# EAGLE design KN-CON + LCD 100мм  (EAGLE 6.2)
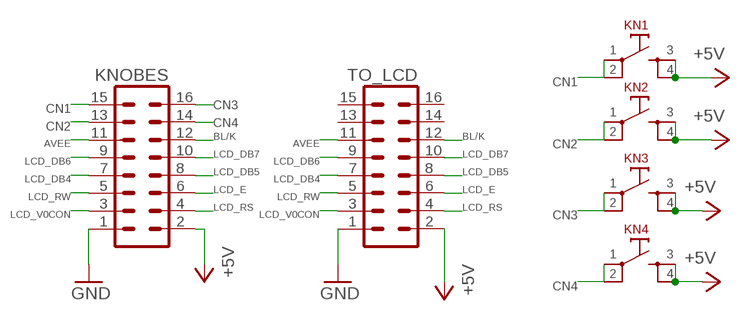
[diagram p0: schematic, sheet 1]

## Parts
KN1  LZQ-KN  [LZQ-KN]
KN2  LZQ-KN  [LZQ-KN]
KN3  LZQ-KN  [LZQ-KN]
KN4  LZQ-KN  [LZQ-KN]
KNOBES  ML16  [ML16]
TO_LCD  ML16  [ML16]

## Nets
+5V: KN1.3 KN1.4 KN2.3 KN2.4 KN3.3 KN3.4 KN4.3 KN4.4 KNOBES.2 TO_LCD.2
AVEE: KNOBES.11 TO_LCD.11
BL/K: KNOBES.12 TO_LCD.12
CN1: KN1.1 KN1.2 KNOBES.15
CN2: KN2.1 KN2.2 KNOBES.13
CN3: KN3.1 KN3.2 KNOBES.16
CN4: KN4.1 KN4.2 KNOBES.14
GND: KNOBES.1 TO_LCD.1
LCD_DB4: KNOBES.7 TO_LCD.7
LCD_DB5: KNOBES.8 TO_LCD.8
LCD_DB6: KNOBES.9 TO_LCD.9
LCD_DB7: KNOBES.10 TO_LCD.10
LCD_E: KNOBES.6 TO_LCD.6
LCD_RS: KNOBES.4 TO_LCD.4
LCD_RW: KNOBES.5 TO_LCD.5
LCD_V0CON: KNOBES.3 TO_LCD.3
Unconnected: TO_LCD.13 TO_LCD.14 TO_LCD.15 TO_LCD.16

## Library data of the parts
KN1-KN4 = Dmitry:LZQ-KN
KNOBES TO_LCD = con-harting-ml:ML16: HARTING; OC_FARNELL: unknown; OC_NEWARK: unknown

## Board
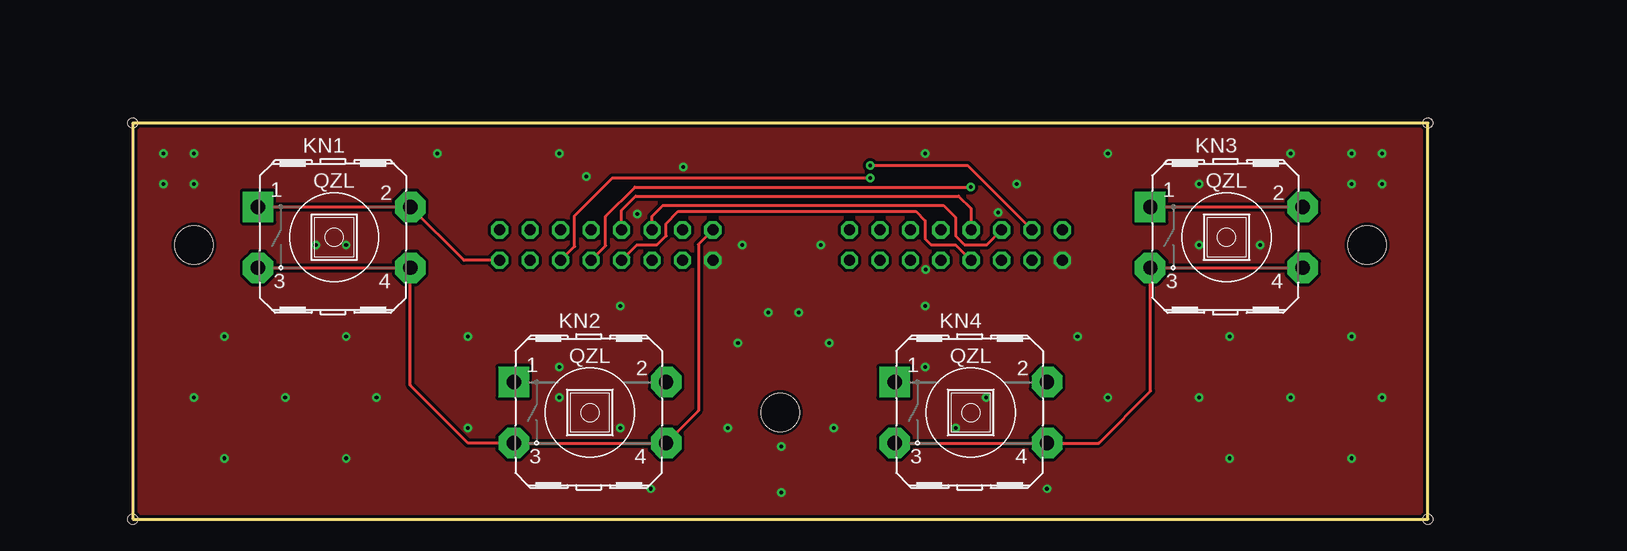
[diagram p1: board, top side]
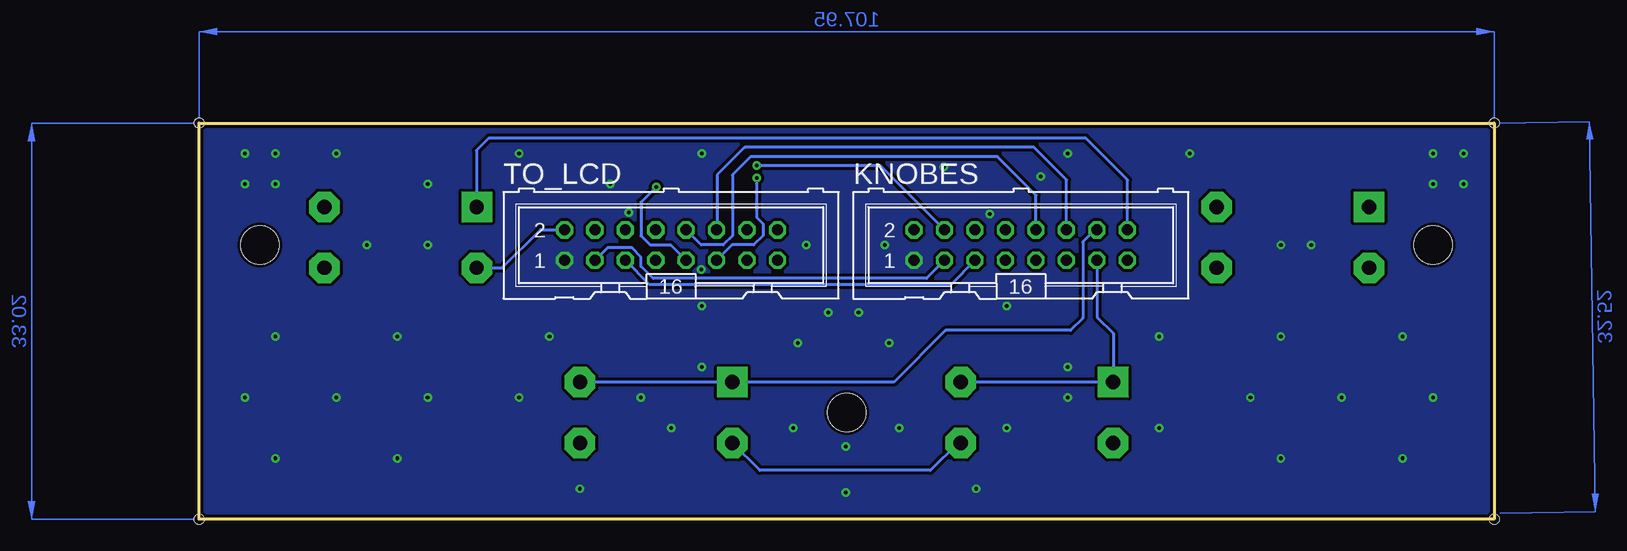
[diagram p2: board, bottom side, seen from below]

Size 107.95 x 33.02 mm. Coordinates in mm from the lower left corner, seen from the top.
Outline: 0,0 107.95,0 107.95,33.02 0,33.02 0,0
Copper layers (1*16): Top 0.035mm / dielectric 1.5mm / Bottom 0.035mm
Design rules: minimum track width 10mil, minimum drill 24mil, track to track 8mil, track to pad 8mil, pad to pad 8mil, via to via 8mil, smd to smd 8mil, copper to edge 10mil, drill to drill 8mil, minimum pad ring 10mil, minimum via ring 8mil, stop-mask expansion 4mil, vias tented up to drill 0mil, thermal gap 10mil
Holes 3.2 mm at 5.08,22.86 102.87,22.86 53.98,8.89
Holes 0.8 mm at 0,33.02 0,0 107.95,0 107.95,33.02

### Footprints (pad centres in the part's own frame; a part is rotated, then mirrored left to right if it is on the bottom)
LZQ-KN = drill 1.2 pad 2.54 square: 1 -6.35,2.54 | drill 1.2 pad 2.54 octagon: 2 6.35,2.54; 3 -6.35,-2.54; 4 6.35,-2.54
ML16 = drill 0.914 octagon: 1 -8.89,-1.27; 2 -8.89,1.27; 3 -6.35,-1.27; 4 -6.35,1.27; 5 -3.81,-1.27; 6 -3.81,1.27; 7 -1.27,-1.27; 8 -1.27,1.27; 9 1.27,-1.27; 10 1.27,1.27; 11 3.81,-1.27; 12 3.81,1.27; 13 6.35,-1.27; 14 6.35,1.27; 15 8.89,-1.27; 16 8.89,1.27

### Placement (x,y rotation side)
KN1  16.78,23.5 0 top
KN2  38.1,8.89 0 top
KN3  91.17,23.5 0 top
KN4  69.85,8.89 0 top
KNOBES  39.46,22.83 0 bottom
TO_LCD  68.61,22.83 0 bottom

### Tracks (layer width: path | path; a pad name or v marks a point on that pad's centre or on a via)
+5V
  Top 0.254: KN1.3 KN1.4 23.11,20.94 23.11,11.18 27.94,6.35 KN2.3 KN2.4 47.14,9.04 47.14,22.9 KNOBES.2 | KN4.3 KN4.4 80.52,6.35 84.84,10.67 84.84,20.94 | 84.84,20.94 KN3.3 | 84.84,20.94 97.5,20.94 KN3.4
  Bottom 0.254: KN2.4 44.7,6.35 46.99,4.06 61.21,4.06 KN4.3 | KN3.3 82.68,20.95 79.5,24.13 77.43,24.13 TO_LCD.2
AVEE  (via drill 0.3 pad 0.6)
  Top 0.254: KNOBES.11 36.83,22.75 36.83,25.3 39.98,28.45 v61.47,28.45
  Bottom 0.254: v61.47,28.45 61.47,25.15 60.96,24.64 60.96,23.62 61.72,22.86 63.51,22.86 TO_LCD.11
BL/K
  Bottom 0.254: KNOBES.12 35.65,28.28 38.35,30.99 62.48,30.99 64.77,28.7 64.77,24.14 TO_LCD.12
CN1
  Top 0.254: KN1.1 KN1.2 27.6,21.57 KNOBES.15
CN2
  Bottom 0.254: KN2.2 KN2.1 31.75,15.49 33.11,16.85 KNOBES.13
CN3
  Top 0.254: KN3.1 KN3.2
  Bottom 0.254: KNOBES.16 30.57,28.28 34.04,31.75 83.82,31.75 84.84,30.73 84.84,26.05 KN3.1
CN4
  Bottom 0.254: KN4.2 KN4.1 50.04,11.43 45.72,15.75 35.31,15.75 34.29,16.76 34.29,23.11 33.3,24.11 KNOBES.14
GND  (via drill 0.3 pad 0.6)
  other vias: 27.94,7.62 35.56,10.16 40.64,7.62 27.94,15.24 43.18,2.54 76.2,2.54 91.44,5.08 101.6,5.08 104.14,10.16 101.6,15.24 104.14,27.94 96.52,30.48 88.9,27.94 81.28,30.48 73.66,27.94 66.04,30.48 52.98,17.22 25.4,30.48 40.64,17.78 55.52,17.22 66.04,17.78 78.74,15.24 81.28,10.16 88.9,10.16 96.52,10.16 91.44,15.24 68.58,7.62 71.12,10.16 58.06,14.68 50.44,14.68 35.56,30.48 50.8,22.86 57.35,22.86 17.78,22.86 15.24,22.86 88.9,22.86 93.98,22.86 7.62,5.08 17.78,5.08 20.32,10.16 17.78,15.24 5.08,10.16 12.7,10.16 7.62,15.24 54.05,2.24 49.58,7.62 5.08,30.48 5.08,27.94 2.54,27.94 2.54,30.48 101.6,27.94 104.14,30.48 101.6,30.48 58.42,7.62 54.05,6.05 35.56,12.7 66.04,12.7 37.8,28.55 45.87,29.36 72.14,25.55 66.09,20.83 42.06,25.45
  pour Top (isolate 0.25, no thermals): 0,33.02 0,0 107.95,0 107.95,33.02
  pour Bottom (isolate 0.25, no thermals): 0,33.02 107.95,33.02 107.95,0 -0.51,0.51
LCD_DB4
  Top 0.254: KNOBES.7 42.02,22.86 43.69,22.86 44.45,23.62 44.45,24.64 45.47,25.65 65.28,25.65 66.04,24.89 66.04,23.37 66.55,22.86 68.58,22.86 TO_LCD.7
LCD_DB5
  Top 0.254: KNOBES.8 40.73,25.74 41.91,26.92 68.83,26.92 69.85,25.91 69.85,24.14 TO_LCD.8
LCD_DB6  (via drill 0.3 pad 0.6)
  Top 0.254: KNOBES.9 39.42,22.8 39.42,25.25 41.86,27.69 v69.85,27.69
  Bottom 0.254: v69.85,27.69 71.12,26.42 71.12,23.62 70.36,22.86 68.64,22.86 TO_LCD.9
LCD_DB7
  Bottom 0.254: KNOBES.10 38.19,27.01 41.4,30.23 61.98,30.23 63.5,28.7 63.5,23.62 64.26,22.86 66.1,22.86 TO_LCD.10
LCD_E
  Top 0.254: KNOBES.6 43.27,25.23 44.2,26.16 67.56,26.16 68.58,25.15 68.58,23.62 69.34,22.86 71.18,22.86 TO_LCD.6
LCD_RS  (via drill 0.3 pad 0.6)
  Top 0.254: TO_LCD.4 69.61,29.46 v61.47,29.46
  Bottom 0.254: KNOBES.4 51.16,29.46 v61.47,29.46
LCD_RW
  Bottom 0.254: KNOBES.5 45.27,19.56 70.42,19.56 TO_LCD.5
LCD_V0CON
  Bottom 0.254: KNOBES.3 47.3,20.07 70.1,20.07 71.12,21.08 71.12,21.84 71.88,22.61 73.92,22.61 TO_LCD.3
(copper drawn outside any net)
  shapes: Bottom area x3

### Text on the board
Drill_legend: Drill legend | Date: 05.05.2012 14:55:05 | 3.2000 mm / 125.984 mil | 1.2000 mm / 47.244 mil | 1.0000 mm / 39.370 mil | 0.8000 mm / 31.496 mil